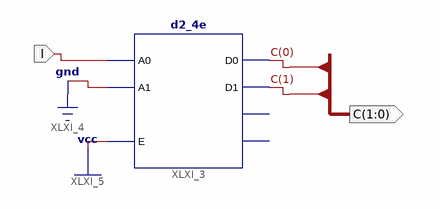
[diagram p0: schematic sheet 1]
// Xilinx ISE schematic Decoder1_2.sch (spartan6) as structural Verilog: 1 symbols, 2 ports
module Decoder1_2 (
  input  I,
  output [1:0] C
);

  d2_4e XLXI_3 (.A0(I), .A1(1'b0), .E(1'b1), .D0(C[0]), .D1(C[1]));  // open: D2, D3
endmodule
